# Altium project Photosensor.PrjPcb
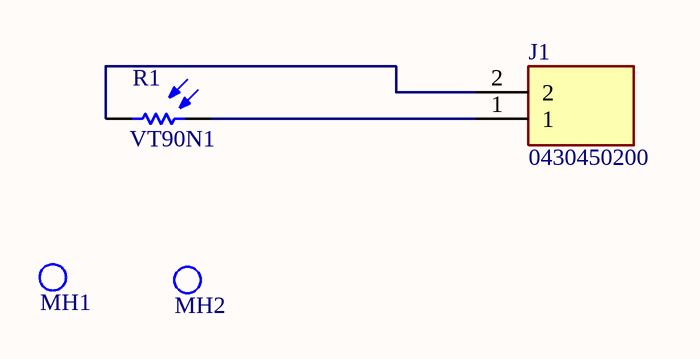
[diagram p0: Photo Board.SchDoc]
1 sheet, 4 parts. Net scope: global (net labels, ports and power ports of the same name join across sheets).
Board file: Photo Board Rec.PcbDoc

## Sheet Photo Board.SchDoc
size A4; SheetNumber: 1; SheetTotal: 1

### Parts
J1  0430450200  [43045-0200]
MH1  Mounting Hole  [MOUNT-HOLE]  (value not drawn)  (no BOM)
MH2  Mounting Hole  [MOUNT-HOLE]  (value not drawn)  (no BOM)
R1  VT90N1  [EXCE-VT90N1]

### Nets
NetJ1_1: J1.1 R1.2
NetJ1_2: J1.2 R1.1

### Library data of the parts
J1 = 0430450200: Connector; Manufacturer_Name: Molex; Datasheet Link: http://www.molex.com/webdocs/datasheets/pdf/en-us//0430450200_PCB_HEADERS.pdf; Manufacturer_Part_Number: 0430450200; Mouser Part Number: N/A; Mouser Price/Stock: https://www.mouser.co.uk/ProductDetail/Molex/0430450200?qs=PBcRNPEHKsq8d1JP3B5UOw%3D%3D; Arrow Part Number: 0430450200; Arrow Price/Stock: https://www.arrow.com/en/products/0430450200/molex
MH1 MH2 = Mounting Hole: #4 Screw, 0.116in Diameter
R1 = CMP-2000-07406-1: Photoconductive Resistor, 200 kOhm, 100 V, 80 mW, -40 to 75 degC, 2-Pin THD, RoHS; Manufacturer: Excelitas Technology; SVHC: Cadmiumchloride(15-Jun-2015); Power Rating: 80mW; Resistance @ Lux: 12kohm; Voltage Rating: 100V; Product Range: -; Datasheet Version: 09/2006; Resistor Case Style: -; Operating Temperature Max: 75°C; Package Reference: VT90N1; Datasheet URL: http://datasheet.octopart.com/VT90N1-Excelitas-datasheet-10388451.pdf; Mounting Technology: ThroughHole; Operating Temperature Min: -40°C; Dark Resistance: 200kohm; Package Description: 2-Pin Through Hole Device, Body Width 4.17 mm (Max), Height 2.29 mm; Manufacturer URL: http://www.excelitas.com/Pages/Index.aspx; Packaging: Each